# Altium schematic sheet Sheet5.SchDoc
size A4
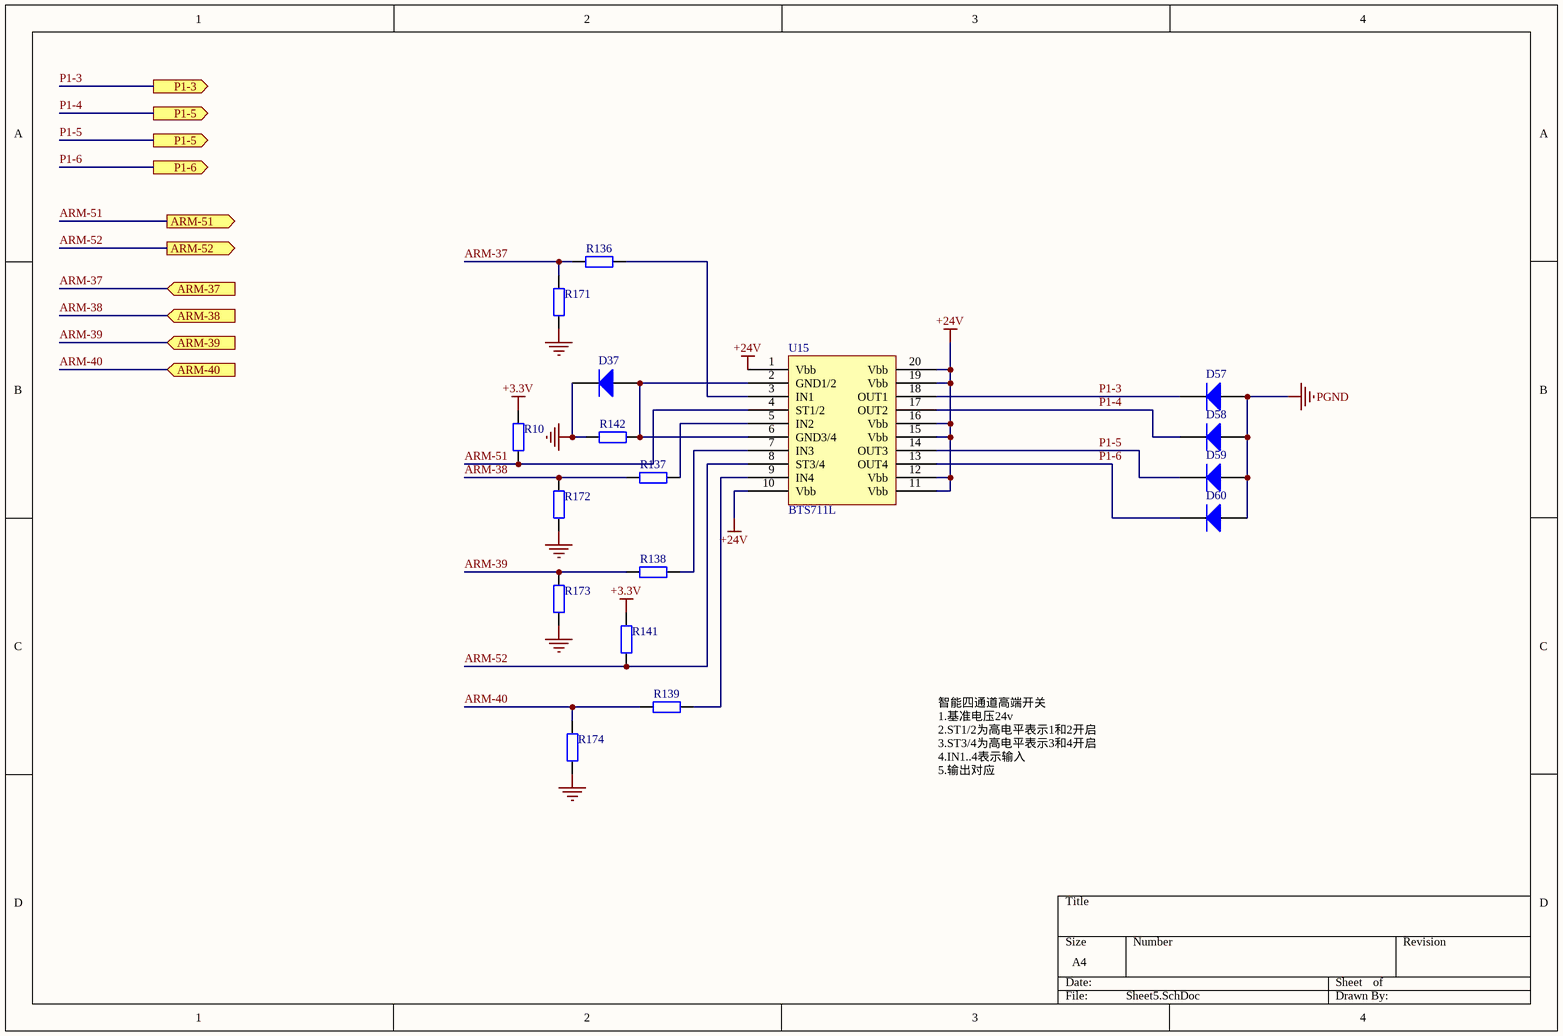
[diagram p0: Sheet5.SchDoc]

## Parts
D37  Diode 1N4007  [DO-41]  (value not drawn)
D57  Diode 1N4007  [DO-41]  (value not drawn)
D58  Diode 1N4007  [DO-41]  (value not drawn)
D59  Diode 1N4007  [DO-41]  (value not drawn)
D60  Diode 1N4007  [DO-41]  (value not drawn)
R10  Res2  [AXIAL-0.4]  (value not drawn)
R136  Res2  [AXIAL-0.4]  (value not drawn)
R137  Res2  [AXIAL-0.4]  (value not drawn)
R138  Res2  [AXIAL-0.4]  (value not drawn)
R139  Res2  [AXIAL-0.4]  (value not drawn)
R141  Res2  [AXIAL-0.4]  (value not drawn)
R142  Res2  [AXIAL-0.4]  (value not drawn)
R171  Res2  [AXIAL-0.4]  (value not drawn)
R172  Res2  [AXIAL-0.4]  (value not drawn)
R173  Res2  [AXIAL-0.4]  (value not drawn)
R174  Res2  [AXIAL-0.4]  (value not drawn)
U15  BTS711L

## Ports
ARM-37 (in), ARM-38 (in), ARM-39 (in), ARM-40 (in), ARM-51 (out), ARM-52 (out), P1-3 (out), P1-5 (out), P1-6 (out)

## Nets
+3.3V: R10.2 R141.2
+24V: U15.1(Vbb) U15.10(Vbb) U15.11(Vbb) U15.12(Vbb) U15.15(Vbb) U15.16(Vbb) U15.19(Vbb) U15.20(Vbb)
GND: D37.2(K) R142.1 R171.1 R172.1 R173.1 R174.1
PGND: D57.1(A) D58.1(A) D59.1(A) D60.1(A)
ARM-37: R136.1 R171.2 ; port ARM-37
ARM-38: R137.1 R172.2 ; port ARM-38
ARM-39: R138.1 R173.2 ; port ARM-39
ARM-40: R139.2 R174.2 ; port ARM-40
ARM-51: R10.1 U15.4(ST1/2) ; port ARM-51
ARM-52: R141.1 U15.8(ST3/4) ; port ARM-52
P1-3: D57.2(K) U15.18(OUT1) ; port P1-3
P1-4: D58.2(K) D59.2(K) U15.14(OUT3) U15.17(OUT2) ; port P1-5  [also labelled P1-5]
P1-6: D60.2(K) U15.13(OUT4) ; port P1-6
NetD37_1: D37.1(A) R142.2 U15.2(GND1/2) U15.6(GND3/4)
NetR136_2: R136.2 U15.3(IN1)
NetR137_2: R137.2 U15.5(IN2)
NetR138_2: R138.2 U15.7(IN3)
NetR139_1: R139.1 U15.9(IN4)

## Notes on the sheet
- 智能四通道高端开关
  1.基准电压24v
  2.ST1/2为高电平表示1和2开启
  3.ST3/4为高电平表示3和4开启
  4.IN1..4表示输入
  5.输出对应

## Library data of the parts
D37 D57-D60 = Diode 1N4007: 1 Amp General Purpose Rectifier; Published: 8-Jun-2000; LatestRevisionDate: 17-Jul-2002; LatestRevisionNote: Re-released for DXP Platform.; DatasheetDocument: 1998; PackageDocument: Aug-1999; PackageReference: DO-41; Publisher: Altium Limited; Code_JEDEC: DO-204-AL; ComponentLink1Description: Manufacturer Link; ComponentLink1URL: http://www.fairchildsemi.com/; ComponentLink2Description: Datasheet; ComponentLink2URL: http://www.fairchildsemi.com/ds/1N%2F1N4001.pdf
R10 R136-R139 R141 R142 R171-R174 = Res2: Resistor; Value: 1K; Published: 8-Jun-2000; LatestRevisionDate: 17-Jul-2002; LatestRevisionNote: Re-released for DXP Platform.; PackageReference: AXIAL-0.4; Publisher: Altium Limited
U15 = Component_1